# EAGLE design sy88932l_strobe_test (EAGLE 9.2.2)
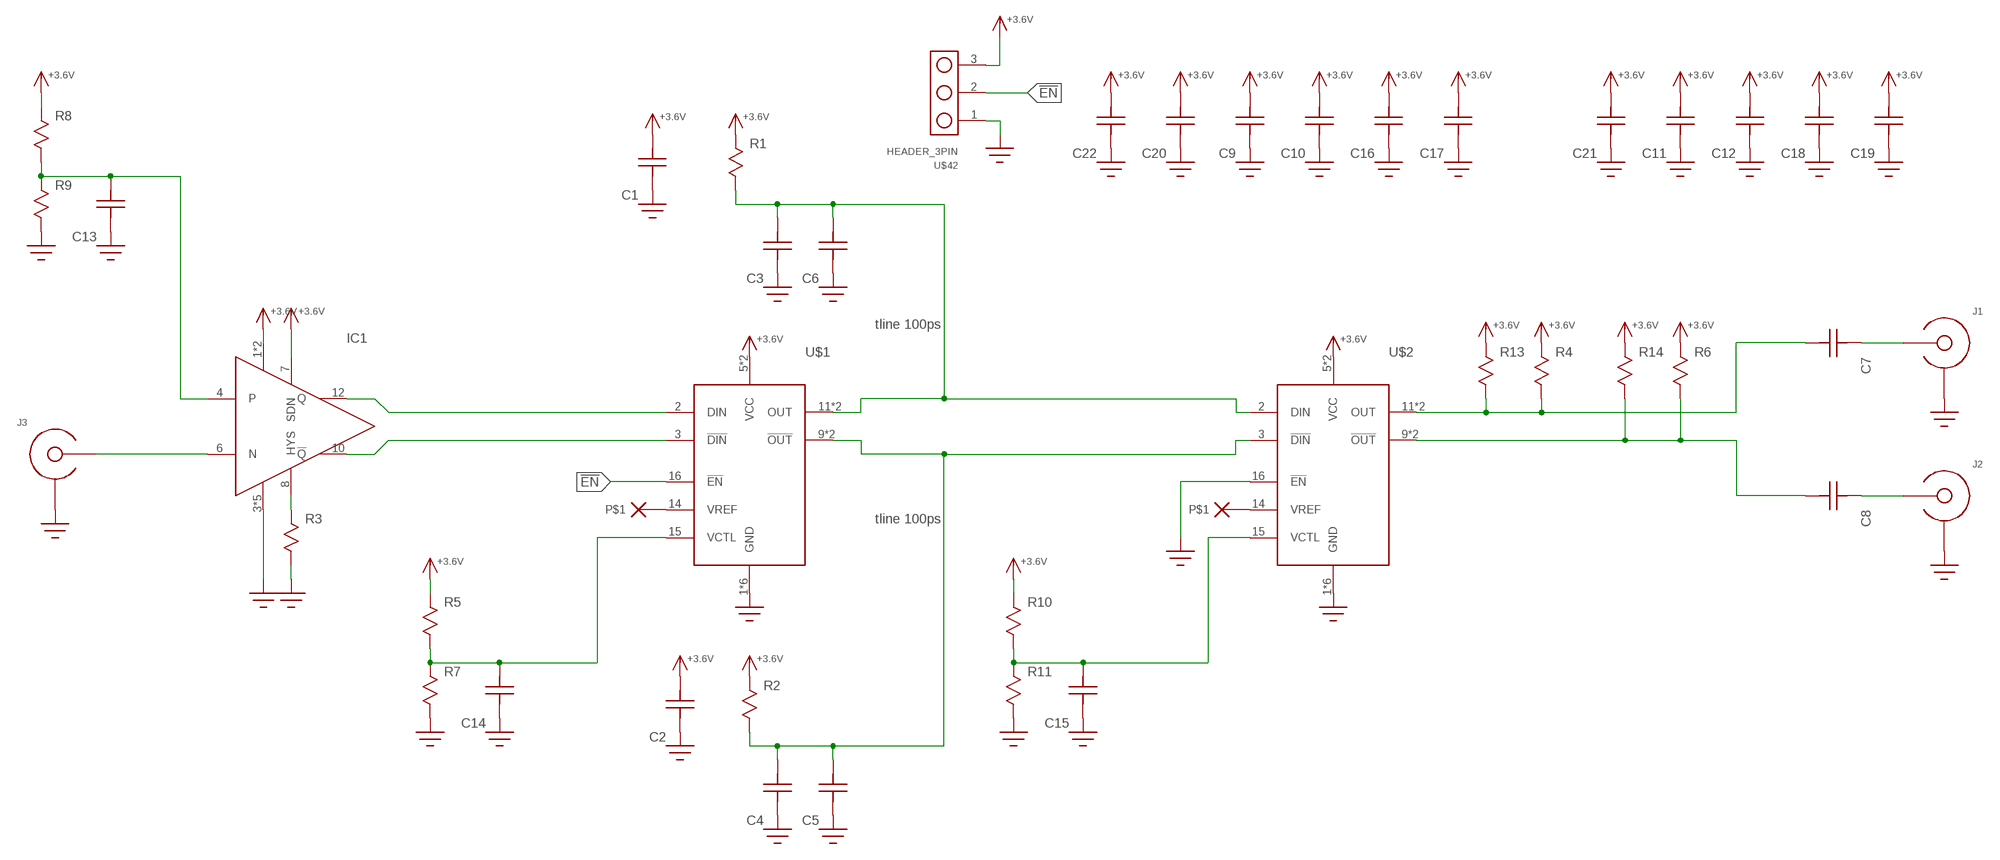
[diagram p0: schematic, sheet 1]

## Parts
C1  C0603  [C0603]
C2  C0603  [C0603]
C3  C  [C0402]
C4  C  [C0402]
C5  C  [C0402]
C6  C  [C0402]
C7  C  [C0402]
C8  C  [C0402]
C9  C  [C0402]
C10  C  [C0402]
C11  C0603  [C0603]
C12  C0603  [C0603]
C13  C0603  [C0603]
C14  C0603  [C0603]
C15  C0603  [C0603]
C16  C  [C0402]
C17  C  [C0402]
C18  C0603  [C0603]
C19  C0603  [C0603]
C20  C  [C0402]
C21  C0603  [C0603]
C22  C1206  [1206]
IC1  ADCMP607  [QFN12-3X3]
J1  SMA_END_LAUNCH4L  [SMA_EDGE_LAUNCH]
J2  SMA_END_LAUNCH4L  [SMA_EDGE_LAUNCH]
J3  SMA_END_LAUNCH4L  [SMA_EDGE_LAUNCH]
R1  R0603  [R0603]
R2  R0603  [R0603]
R3  R0402  [0402]
R4  R0402  [0402]
R5  R0603  [R0603]
R6  R0402  [0402]
R7  R0603  [R0603]
R8  R0603  [R0603]
R9  R0603  [R0603]
R10  R0603  [R0603]
R11  R0603  [R0603]
R13  R0402  [0402]
R14  R0402  [0402]
U$1  SY88932L  [TQFN16]
U$2  SY88932L  [TQFN16]
U$36  NO_CONNECT  (no package)
U$37  NO_CONNECT  (no package)
U$42  HEADER_3PIN  [HEADER_3PIN]

## Nets
!EN!: U$1.16(!EN!) U$42.2
+3.6V: C1.P$1 C2.P$1 C9.1 C10.1 C11.P$1 C12.P$1 C16.1 C17.1 C18.P$1 C19.P$1 C20.1 C21.P$1 C22.P$1 IC1.1(VCC) IC1.2(VCC) IC1.7(SDN) R1.P$1 R2.P$1 R4.1 R5.P$1 R6.1 R8.P$1 R10.P$1 R13.1 R14.1 U$1.5(VCC) U$1.6(VCC) U$2.5(VCC) U$2.6(VCC) U$42.3
GND: C1.P$2 C2.P$2 C3.2 C4.2 C5.2 C6.2 C9.2 C10.2 C11.P$2 C12.P$2 C13.P$2 C14.P$2 C15.P$2 C16.2 C17.2 C18.P$2 C19.P$2 C20.2 C21.P$2 C22.P$2 IC1.3(VEE) IC1.5(VEE) IC1.9(VEE) IC1.11(VEE) IC1.EP(VEE) J1.BOTTOM_PAD(SHIELD) J1.GND@1(SHIELD) J1.GND@2(SHIELD) J1.GND@3(SHIELD) J1.GND@4(SHIELD) J1.GND@5(SHIELD) J1.GND@6(SHIELD) J1.GND@7(SHIELD) J1.GND@8(SHIELD) J1.GND@14(SHIELD) J1.GND@15(SHIELD) J1.GND@16(SHIELD) J1.GND@17(SHIELD) J1.GND_PAD1(SHIELD) J1.GND_PAD2(SHIELD) J2.BOTTOM_PAD(SHIELD) J2.GND@1(SHIELD) J2.GND@2(SHIELD) J2.GND@3(SHIELD) J2.GND@4(SHIELD) J2.GND@5(SHIELD) J2.GND@6(SHIELD) J2.GND@7(SHIELD) J2.GND@8(SHIELD) J2.GND@14(SHIELD) J2.GND@15(SHIELD) J2.GND@16(SHIELD) J2.GND@17(SHIELD) J2.GND_PAD1(SHIELD) J2.GND_PAD2(SHIELD) J3.BOTTOM_PAD(SHIELD) J3.GND@1(SHIELD) J3.GND@2(SHIELD) J3.GND@3(SHIELD) J3.GND@4(SHIELD) J3.GND@5(SHIELD) J3.GND@6(SHIELD) J3.GND@7(SHIELD) J3.GND@8(SHIELD) J3.GND@14(SHIELD) J3.GND@15(SHIELD) J3.GND@16(SHIELD) J3.GND@17(SHIELD) J3.GND_PAD1(SHIELD) J3.GND_PAD2(SHIELD) R3.2 R7.P$2 R9.P$2 R11.P$2 U$1.1(GND) U$1.4(GND) U$1.7(GND) U$1.8(GND) U$1.13(GND) U$1.EP(GND) U$2.1(GND) U$2.4(GND) U$2.7(GND) U$2.8(GND) U$2.13(GND) U$2.16(!EN!) U$2.EP(GND) U$42.1
N$1: IC1.12(Q) U$1.2(DIN)
N$2: IC1.10(!Q!) U$1.3(!DIN!)
N$3: IC1.8(HYS) R3.1
N$4: U$2.14(VREF) U$36.P$1
N$5 [13/7]: C3.1 C6.1 R1.P$2 U$1.11(OUT) U$1.12(OUT) U$2.2(DIN)
N$6: C7.2 J1.CENTER@1(CENTER) J1.CENTER@2(CENTER)
N$7 [13/7]: C4.1 C5.1 R2.P$2 U$1.9(!OUT!) U$1.10(!OUT!) U$2.3(!DIN!)
N$8: C8.2 J2.CENTER@1(CENTER) J2.CENTER@2(CENTER)
N$9: U$1.14(VREF) U$37.P$1
N$10: C13.P$1 IC1.4(P) R8.P$2 R9.P$1
N$11: IC1.6(N) J3.CENTER@1(CENTER) J3.CENTER@2(CENTER)
N$12: C14.P$1 R5.P$2 R7.P$1 U$1.15(VCTL)
N$13 [13/7]: C7.1 R4.2 R13.2 U$2.11(OUT) U$2.12(OUT)
N$14 [13/7]: C8.1 R6.2 R14.2 U$2.9(!OUT!) U$2.10(!OUT!)
N$15: C15.P$1 R10.P$2 R11.P$1 U$2.15(VCTL)

## Notes on the sheet
- tline 100ps
- tline 100ps

## Library data of the parts
C1-C22 = yapo:C
IC1 = yapo:ADCMP607
J1-J3 = yapo:SMA_END_LAUNCH
R1-R11 R13 R14 = yapo:R
U$1 U$2 = yapo:SY88932L
U$36 U$37 = yapo:NO_CONNECT
U$42 = yapo:HEADER_3PIN

## Net classes
1 13/7: width 0.33 mm, clearance 0.178 mm

## Board
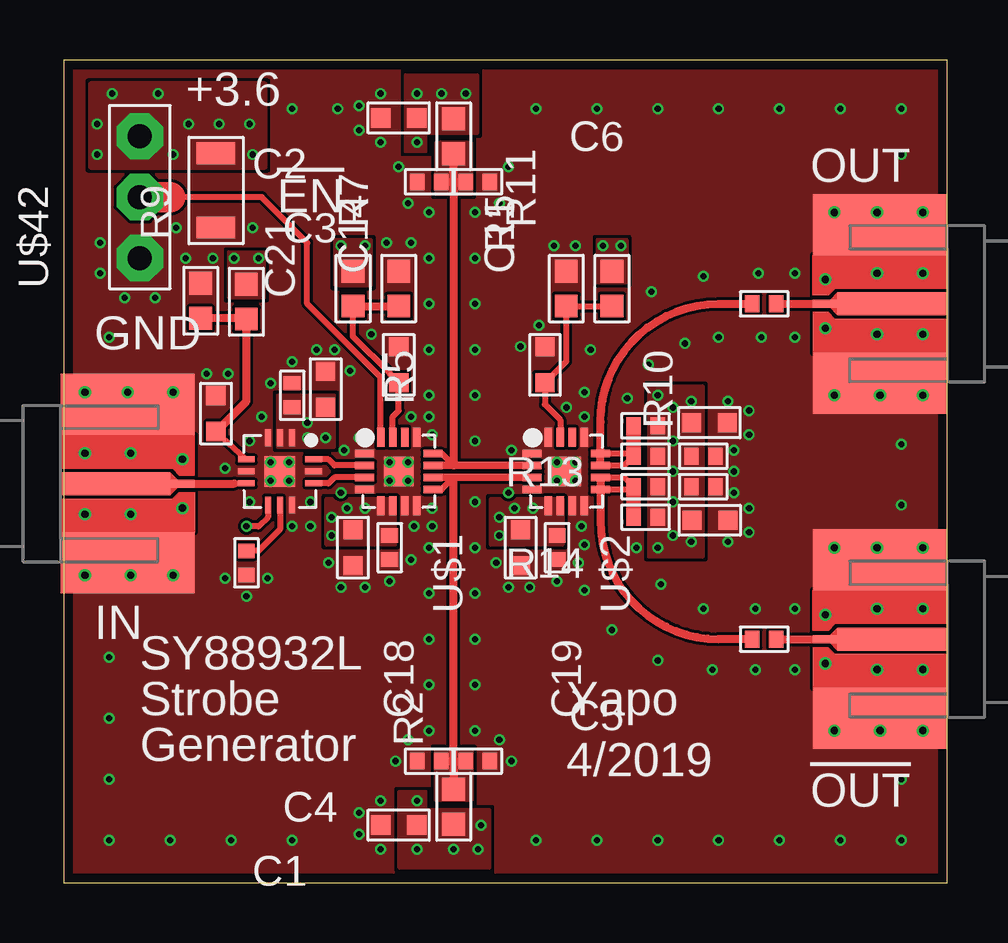
[diagram p1: board, top side]
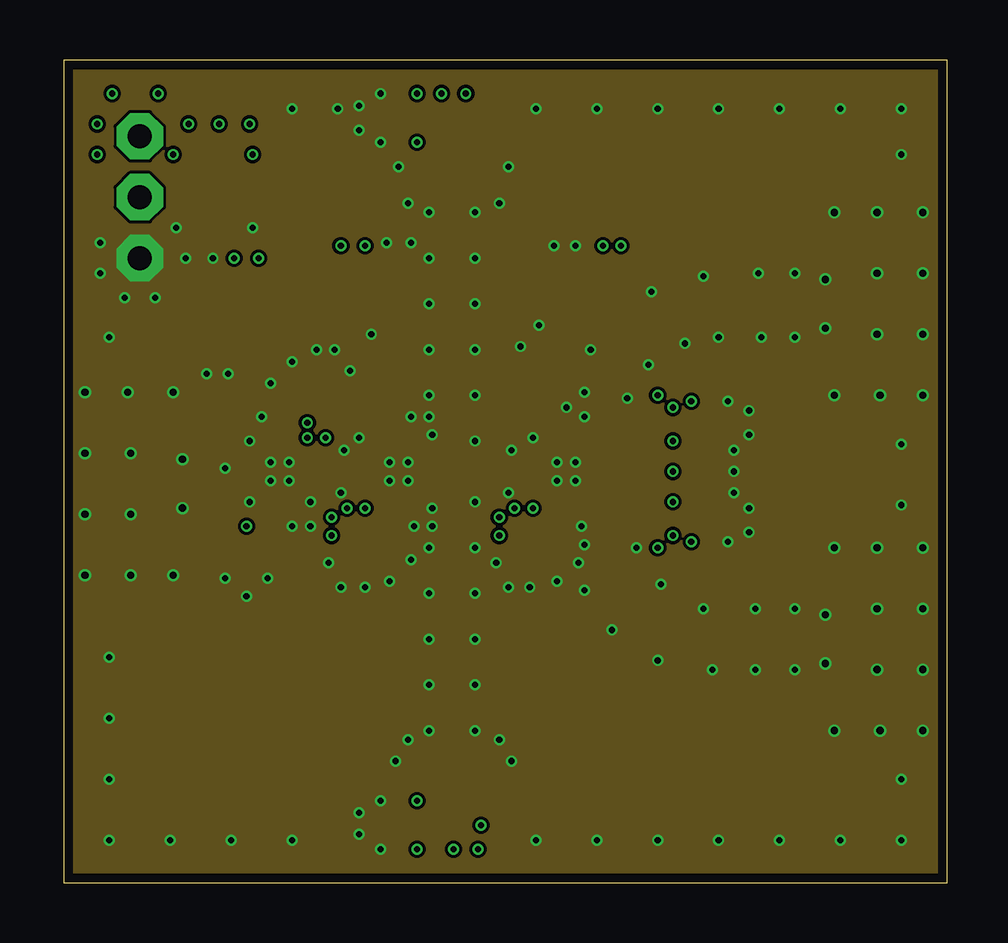
[diagram p2: board, inner layer Route2]
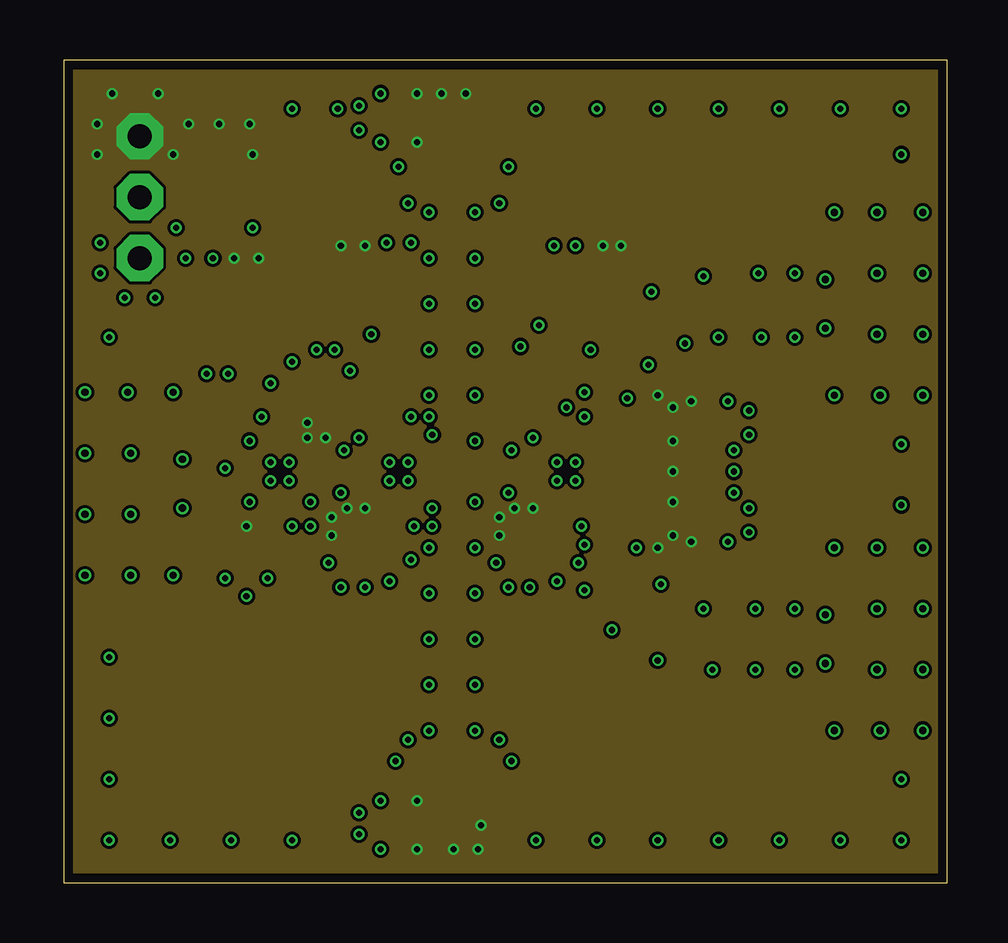
[diagram p3: board, inner layer Route15]
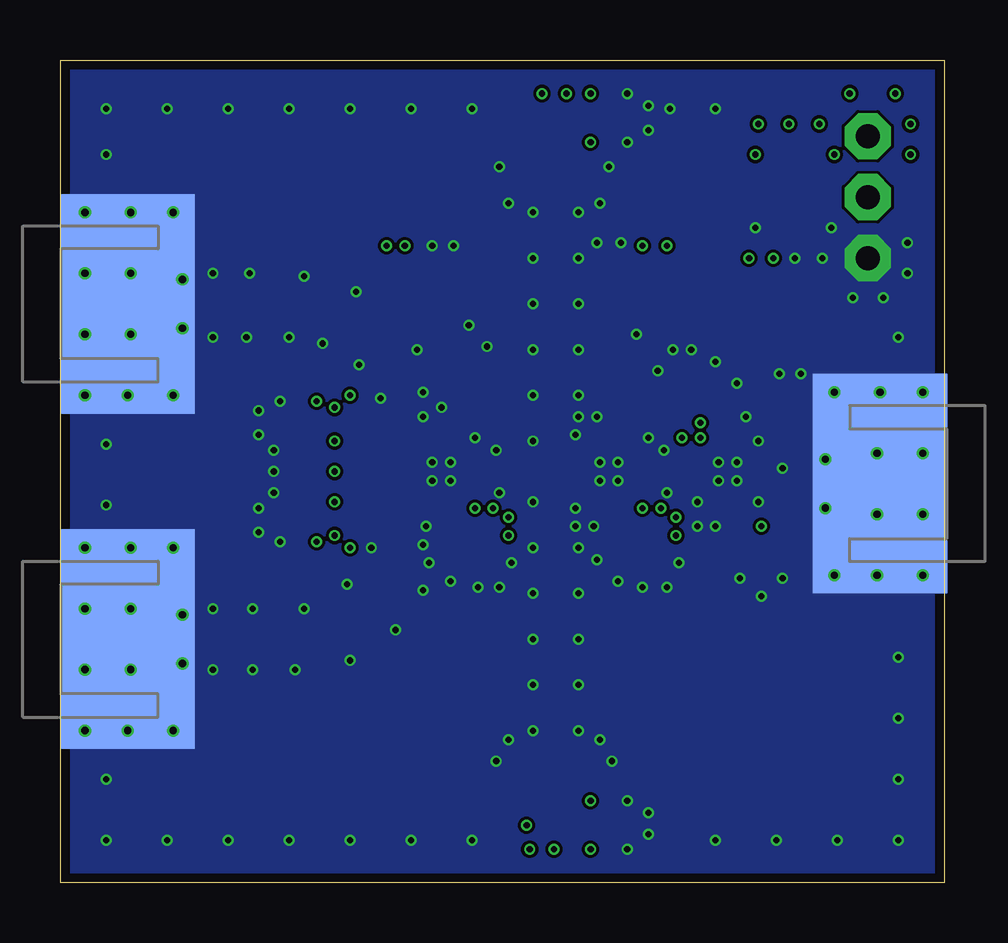
[diagram p4: board, bottom side, seen from below]

Size 36.83 x 34.29 mm. Coordinates in mm from the lower left corner, seen from the top.
Outline: 0,0 36.83,0 36.83,34.29 0,34.29 0,0
Copper layers (1*2*15*16): Top 0.035559375mm / dielectric 0.17018125mm / Route2 0.01778125mm / dielectric 47mil / Route15 0.01778125mm / dielectric 0.17018125mm / Bottom 0.035559375mm
Design rules "oshpark-4layer *": minimum track width 5mil, minimum drill 10mil, track to track 5mil, track to pad 5mil, pad to pad 5mil, via to via 5mil, smd to smd 5mil, copper to edge 15mil, drill to drill 6mil, minimum pad ring 4mil, minimum via ring 4mil, stop-mask expansion 2.5mil, vias tented up to drill 20mil, thermal gap 10mil

### Footprints (pad centres in the part's own frame; a part is rotated, then mirrored left to right if it is on the bottom)
C0603 = smd 0.8 x 0.8: P$1 -0.75,0; P$2 0.75,0
C0402 = smd 0.6 x 0.7: 1 -0.5,0; 2 0.5,0
1206 = smd 0.9 x 1.6: P$1 -1.55,0; P$2 1.55,0
QFN12-3X3 = smd 0.7 x 0.25: 1 -1.4,0.5; 2 -1.4,0; 3 -1.4,-0.5; 7 1.4,-0.5; 8 1.4,0; 9 1.4,0.5 | smd 0.25 x 0.7: 4 -0.5,-1.4; 5 0,-1.4; 6 0.5,-1.4; 10 0.5,1.4; 11 0,1.4; 12 -0.5,1.4 | smd 1.27 x 1.27: EP 0,0
SMA_EDGE_LAUNCH = smd 5.588 x 9.144 bottom: BOTTOM_PAD 2.794,0 | smd 4.572 x 0.965: CENTER@1 2.286,0 | smd 1.016 x 0.33: CENTER@2 5.08,0 | drill 0.3: GND@1 1.016,3.81; GND@2 4.699,3.81; GND@3 1.016,1.27; GND@4 5.08,1.016; GND@5 1.016,-1.27; GND@6 5.08,-1.016; GND@7 1.016,-3.81; GND@8 4.699,-3.81; GND@14 2.794,3.81; GND@15 2.921,-3.81; GND@16 2.921,-1.27; GND@17 2.921,1.27 | smd 5.588 x 2.54: GND_PAD1 2.794,3.302; GND_PAD2 2.794,-3.302
R0603 = smd 0.95 x 0.95: P$1 -0.725,0; P$2 0.725,0
0402 = smd 0.6 x 0.7: 1 -0.5,0; 2 0.5,0
TQFN16 = smd 0.3 x 0.8: 1 -0.75,-1.425; 2 -0.25,-1.425; 3 0.25,-1.425; 4 0.75,-1.425; 9 0.75,1.425; 10 0.25,1.425; 11 -0.25,1.425; 12 -0.75,1.425 | smd 0.8 x 0.3: 5 1.425,-0.75; 6 1.425,-0.25; 7 1.425,0.25; 8 1.425,0.75; 13 -1.425,0.75; 14 -1.425,0.25; 15 -1.425,-0.25; 16 -1.425,-0.75 | smd 1.23 x 1.23: EP 0,0
HEADER_3PIN = drill 1 pad 1.93 octagon: 1 -2.54,0; 2 0,0; 3 2.54,0

### Placement (x,y rotation side)
C1  13.97,2.41 180 top
C2  13.97,31.88 180 top
C3  15.24,29.21 180 top
C4  15.24,5.08 180 top
C5  17.27,5.08 0 top
C6  17.27,29.21 0 top
C7  29.21,24.13 0 top
C8  29.21,10.16 0 top
C9  26.67,17.78 0 top
C10  26.67,16.51 0 top
C11  26.94,15.11 0 top
C12  26.92,19.18 0 top
C13  6.35,19.56 90 top
C14  13.97,21.59 90 top
C15  20.07,21.59 90 top
C16  13.59,13.97 270 top
C17  20.57,13.97 270 top
C18  12.06,13.97 270 top
C19  19.05,13.97 270 top
C20  9.53,20.32 90 top
C21  10.92,20.57 90 top
C22  6.35,28.86 270 top
IC1  9.02,17.14 270 top
J1  36.83,24.13 180 top
J2  36.83,10.16 180 top
J3  -0.13,16.64 0 top
R1  16.26,31.11 270 top
R2  16.26,3.17 90 top
R3  7.62,13.34 270 top
R4  24.26,17.78 180 top
R5  12.06,24.77 270 top
R6  24.26,16.51 180 top
R7  13.97,24.77 90 top
R8  7.62,24.22 270 top
R9  5.71,24.26 90 top
R10  22.86,24.77 270 top
R11  20.95,24.77 90 top
R13  24.26,19.05 180 top
R14  24.26,15.24 180 top
U$1  13.97,17.14 270 top
U$2  20.95,17.14 270 top
U$42  3.17,28.57 90 top

### Tracks (layer width: path | path; a pad name or v marks a point on that pad's centre or on a via)
!EN!
  Top 0.254: 4.45,28.57 8.26,28.57 10.16,26.67 10.16,24.13 13.22,21.07 U$1.16
  Top 1.27: 4.45,28.57 U$42.2
+3.6V  (via drill 0.25)
  Top 0.254: IC1.7 8.52,15.25 8.13,14.86 v7.62,14.86
  other vias: 25.4,18.41 25.4,17.14 25.4,15.88 25.4,19.81 25.4,14.48 26.16,20.07 26.16,14.22 24.77,20.32 24.77,13.97 12.57,15.62 11.81,15.62 11.18,14.48 11.18,15.24 19.56,15.62 18.8,15.62 18.16,15.24 18.16,14.48 7.11,26.04 8.13,26.04 11.56,26.54 12.57,26.54 23.24,26.54 22.48,26.54 17.4,2.41 14.73,3.43 14.73,1.4 16.26,1.4 17.27,1.4 15.75,32.89 16.76,32.89 14.73,32.89 14.73,30.86 10.16,18.54 10.92,18.54 10.16,19.18 5.21,31.62 6.48,31.62 7.75,31.62 7.87,30.35 4.57,30.35 2.03,32.89 1.4,31.62 1.4,30.35 3.94,32.89
  pour Route15 (no thermals): 0,0 36.83,0 36.83,34.29 0,34.29
  pour Top (no thermals): 24.38,20.7 24.38,13.59 26.67,13.59 26.67,20.7
  pour Top (no thermals): 13.84,16 10.92,16 10.92,14.1 13.84,14.1
  pour Top (no thermals): 17.78,14.1 20.83,14.1 20.83,16 17.78,16
  pour Top (no thermals): 6.86,26.29 6.86,24.38 8.38,24.38 8.38,26.29
  pour Top (no thermals): 11.3,26.8 11.3,24.89 12.83,24.89 12.83,26.8
  pour Top (no thermals): 22.23,26.8 22.23,25.02 23.5,25.02 23.5,26.8
  pour Top (no thermals): 13.97,3.81 13.97,0.64 17.78,0.64 17.78,3.05 15.11,3.05 15.11,3.81
  pour Top (no thermals): 14.22,33.66 14.22,30.48 15.11,30.48 15.11,31.24 17.27,31.24 17.27,33.66
  pour Top (no thermals): 8.89,20.32 8.89,18.16 11.3,18.16 11.3,20.32
  pour Top (no thermals): 1.14,29.84 8.38,29.84 8.38,33.27 1.14,33.27
GND  (via drill 0.25)
  other vias: 28.57,19.68 28.57,18.67 27.94,18.03 27.94,17.14 27.94,16.26 28.57,15.62 28.57,14.61 27.69,14.22 27.69,20.07 15.24,27.94 17.14,27.94 15.24,26.04 15.24,24.13 15.24,22.23 15.24,20.32 17.14,20.32 17.14,22.23 17.14,24.13 17.14,26.04 15.24,6.35 17.14,6.35 17.14,8.26 17.14,10.16 17.14,12.06 17.14,13.97 15.24,13.97 15.24,12.06 15.24,10.16 15.24,8.26 17.14,18.41 17.14,15.88 15.37,15.62 15.37,18.67 21.34,26.54 20.45,26.54 14.48,26.67 13.46,26.67 5.08,26.04 6.22,26.04 1.52,26.67 1.52,25.4 2.54,24.38 3.81,24.38 12.32,32.38 12.32,31.37 13.21,30.86 13.21,32.89 13.21,3.43 12.32,2.92 12.32,2.03 13.21,1.4 11.56,12.32 12.57,12.32 11.05,13.34 6.73,12.7 8.51,12.7 7.62,11.94 21.46,13.34 18.54,12.32 5.97,21.21 6.86,21.21 13.59,12.57 14.48,13.46 8.64,17.53 14.35,17.53 21.34,17.53 20.57,12.57 19.43,12.32 18.03,13.34 12.32,18.54 19.56,18.54 20.95,19.81 18.67,18.03 11.68,18.03 11.56,16.26 18.54,16.26 14.48,19.43 14.61,14.86 21.59,14.86 15.37,14.86 21.72,14.1 21.72,19.43 21.72,20.45 15.24,19.43 12.83,22.86 19.81,23.24 19.05,22.35 13.84,5.08 18.16,5.97 14.35,5.97 18.67,5.08 14.35,28.32 18.16,28.32 18.54,29.84 13.97,29.84 6.73,17.27 10.29,15.88 9.53,14.86 10.29,14.86 7.75,18.41 8.26,19.43 8.64,20.83 9.53,21.72 11.3,22.23 11.94,21.34 7.75,15.88 10.54,22.23 30.48,11.43 4.7,27.3 7.87,27.3 30.48,8.89 26.67,11.43 27.05,8.89 24.89,12.45 23.88,13.97 21.72,12.19 22.86,10.54 24.77,9.27 28.83,8.89 28.83,11.43 30.48,22.73 30.48,25.4 28.96,25.4 26.67,25.27 24.51,24.64 21.97,22.23 29.08,22.73 27.3,22.73 25.91,22.48 24.38,21.59 23.5,20.19 1.91,1.78 4.45,1.78 6.99,1.78 9.53,1.78 19.68,1.78 22.23,1.78 24.77,1.78 27.3,1.78 29.84,1.78 32.38,1.78 34.92,1.78 1.91,4.32 1.91,6.86 1.91,9.4 1.91,22.73 11.43,32.26 9.53,32.26 19.68,32.26 22.23,32.26 24.77,32.26 27.3,32.26 29.84,32.26 32.38,32.26 34.92,32.26 34.92,30.35 34.92,4.32 34.92,15.75 34.92,18.29 21.34,16.76 20.57,16.76 20.57,17.53 14.35,16.76 13.59,16.76 13.59,17.53 9.4,17.53 9.4,16.76 8.64,16.76
  pour Top (rank 2, no thermals): 0,0 36.83,0 36.83,34.29 0,34.29
  pour Bottom (no thermals): 0,0 36.83,0 36.83,34.29 0,34.29
  pour Route2 (no thermals): 0,0 36.83,0 36.83,34.29 0,34.29
N$1
  Top 0.254: IC1.12 11.04,17.64 11.29,17.39 U$1.2
N$2
  Top 0.254: IC1.10 11.04,16.64 11.29,16.89 U$1.3
N$3
  Top 0.254: IC1.8 9.02,14.73 8.12,13.84 R3.1
N$5
  Top 0.254: U$1.12 15.76,17.89 16.24,17.41
  Top 0.305: U$1.11 16.26,17.39 U$2.2
  Top 0.33: 16.24,17.41 16.26,17.39 16.26,29.21 | C3.1 16.26,29.21 | 16.26,29.21 C6.1 | 16.26,29.21 R1.P$2
  pour Top (no thermals): 15.49,28.7 17.02,28.7 17.02,30.86 15.49,30.86
N$6
  Top 0.33: C7.2 J1.CENTER@2 J1.CENTER@1
N$7
  Top 0.254: U$1.9 15.76,16.39 16.26,16.89
  Top 0.305: U$1.10 16.26,16.89 U$2.3
  Top 0.33: C4.1 16.26,5.08 | 16.26,5.08 C5.1 | 16.26,5.08 16.26,16.89 | 16.26,5.08 R2.P$2
  pour Top (no thermals): 15.49,5.59 17.02,5.59 17.02,3.43 15.49,3.43
N$8
  Top 0.33: C8.2 J2.CENTER@2 J2.CENTER@1
N$10
  Top 0.254: IC1.4 C13.P$1
  Top 0.33: C13.P$1 7.62,20.08 R8.P$2 7.58,23.53 R9.P$1
N$11
  Top 0.254: 7.12,16.64 IC1.6
  Top 0.33: 7.12,16.64 7.11,16.64 J3.CENTER@1 J3.CENTER@2
N$12
  Top 0.254: U$1.15 13.72,19.43 13.97,19.68 C14.P$1 13.6,21.21 13.6,21.23 12.06,22.76 R5.P$2
  Top 0.33: R5.P$2 R7.P$1
N$13
  Top 0.254: U$2.12 23.64,17.89 | U$2.11 23.37,17.39 R4.2
  Top 0.33: C7.1 27.3,24.13 arc90 22.38,19.2 U$2.12 U$2.11 | 23.64,17.89 arc-90 R4.2
  Top 0.61: R13.2 R4.2
N$14
  Top 0.254: U$2.10 23.37,16.89 R6.2 | U$2.9 23.64,16.39
  Top 0.33: C8.1 27.3,10.16 arc-90 22.38,15.09 U$2.9 U$2.10 | 23.64,16.39 arc90 R6.2
  Top 0.61: R14.2 R6.2
N$15
  Top 0.254: R10.P$2 R11.P$1 20.95,21.73 C15.P$1 20.07,19.94 20.7,19.3 U$2.15

### Text on the board
tPlace: +3.6 | OUT | !EN! | GND | IN | SY88932L | Strobe | Yapo | Generator | 4/2019 | !OUT!